# EAGLE schematic OpIoT_jetson_v_1_5 (EAGLE 9.6.2)
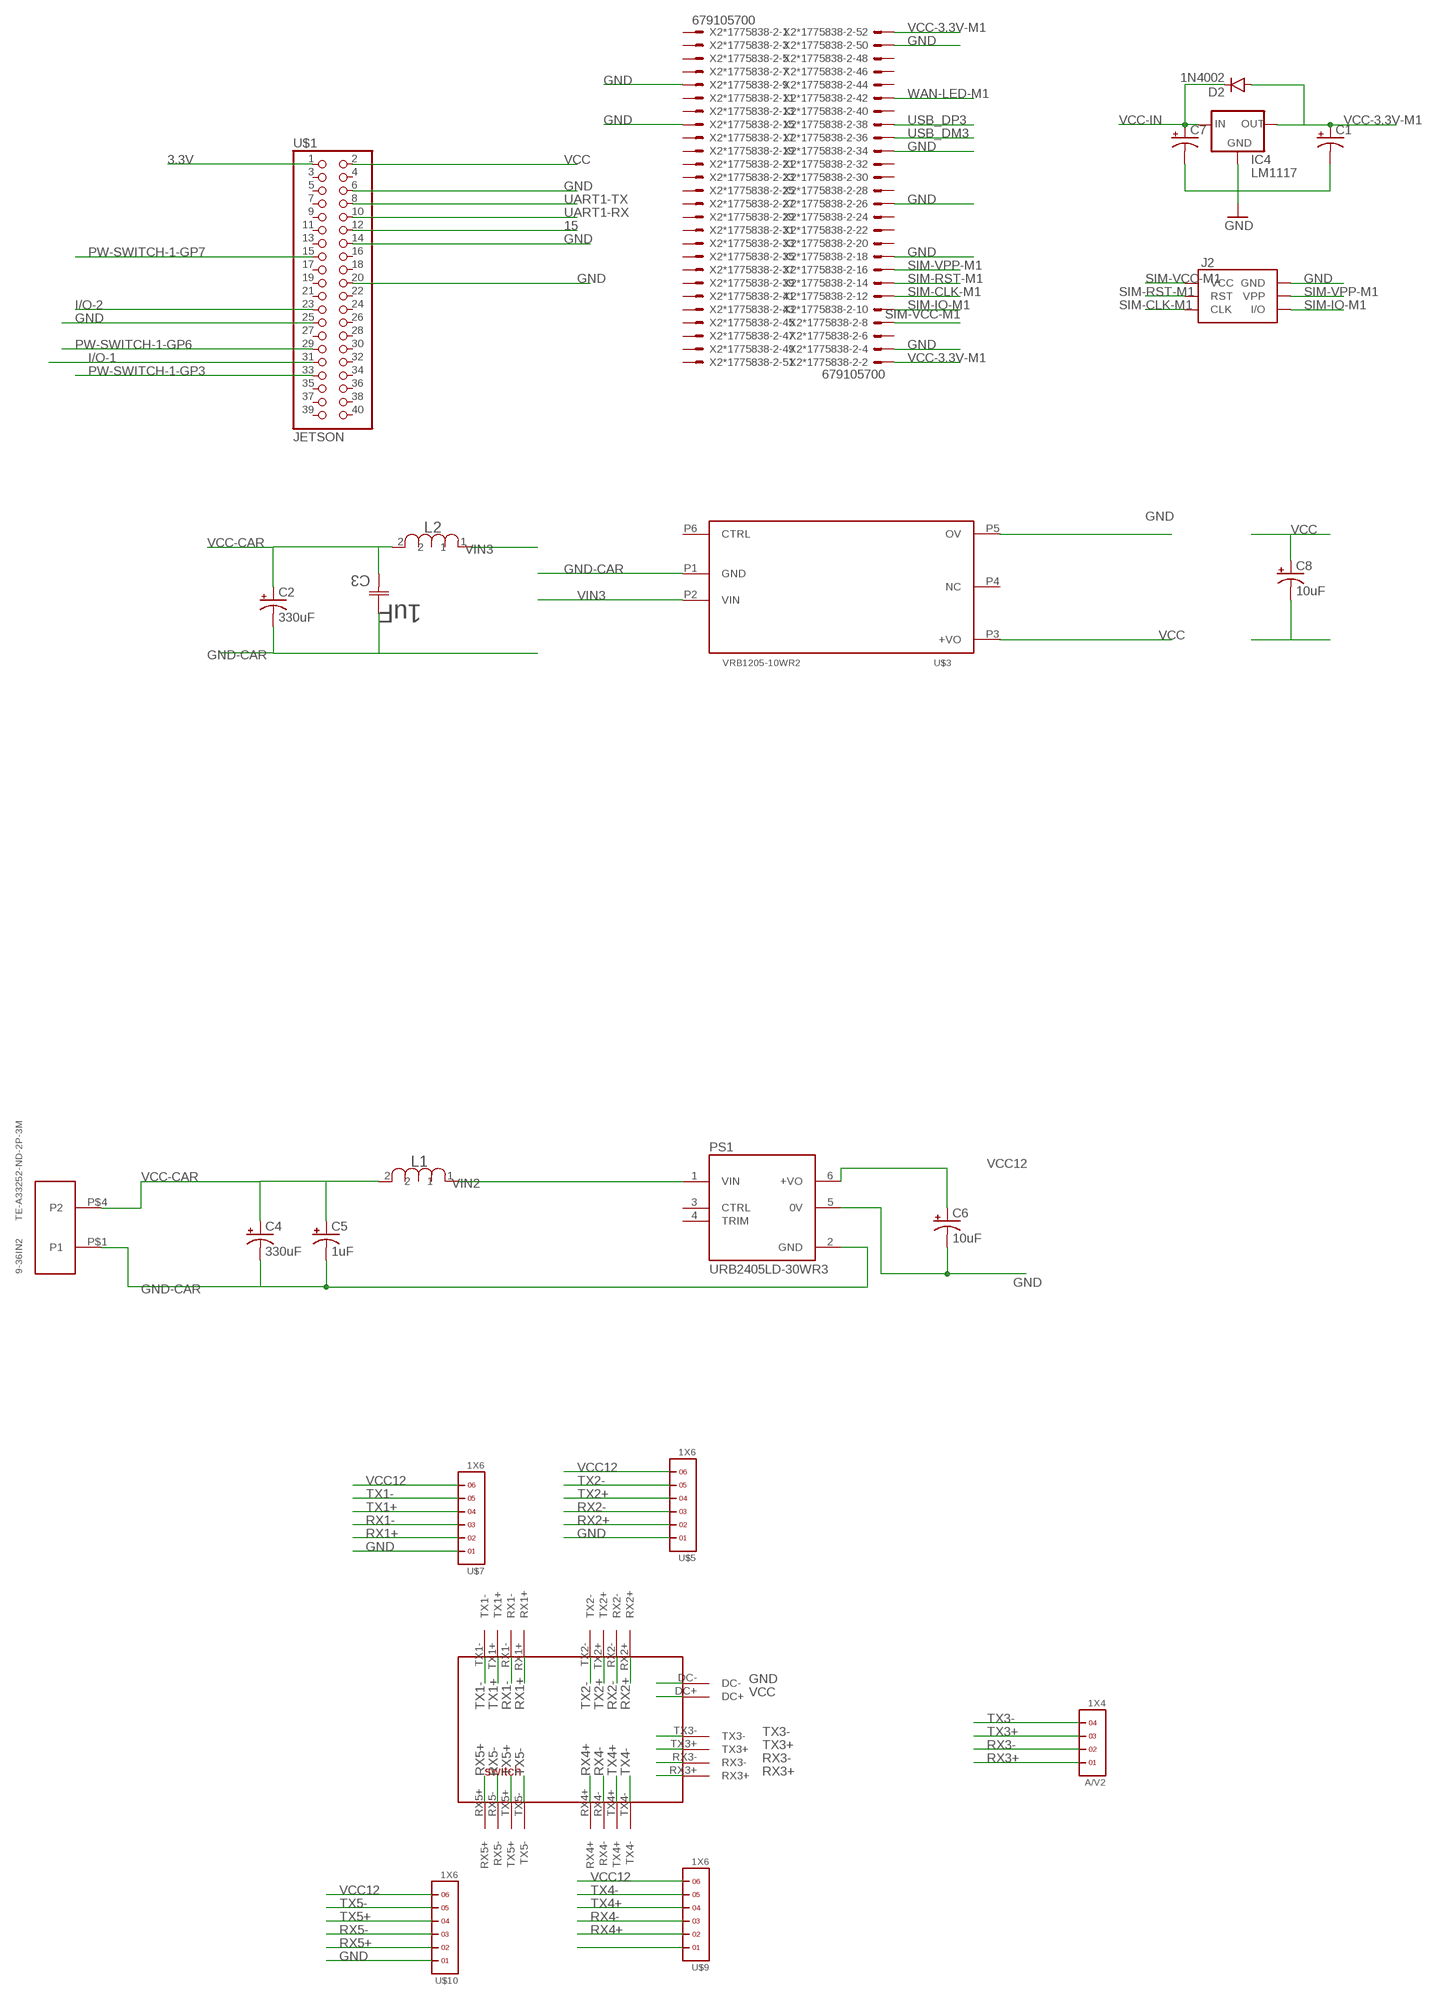
[diagram p0: schematic, sheet 1, part 1 of 3]
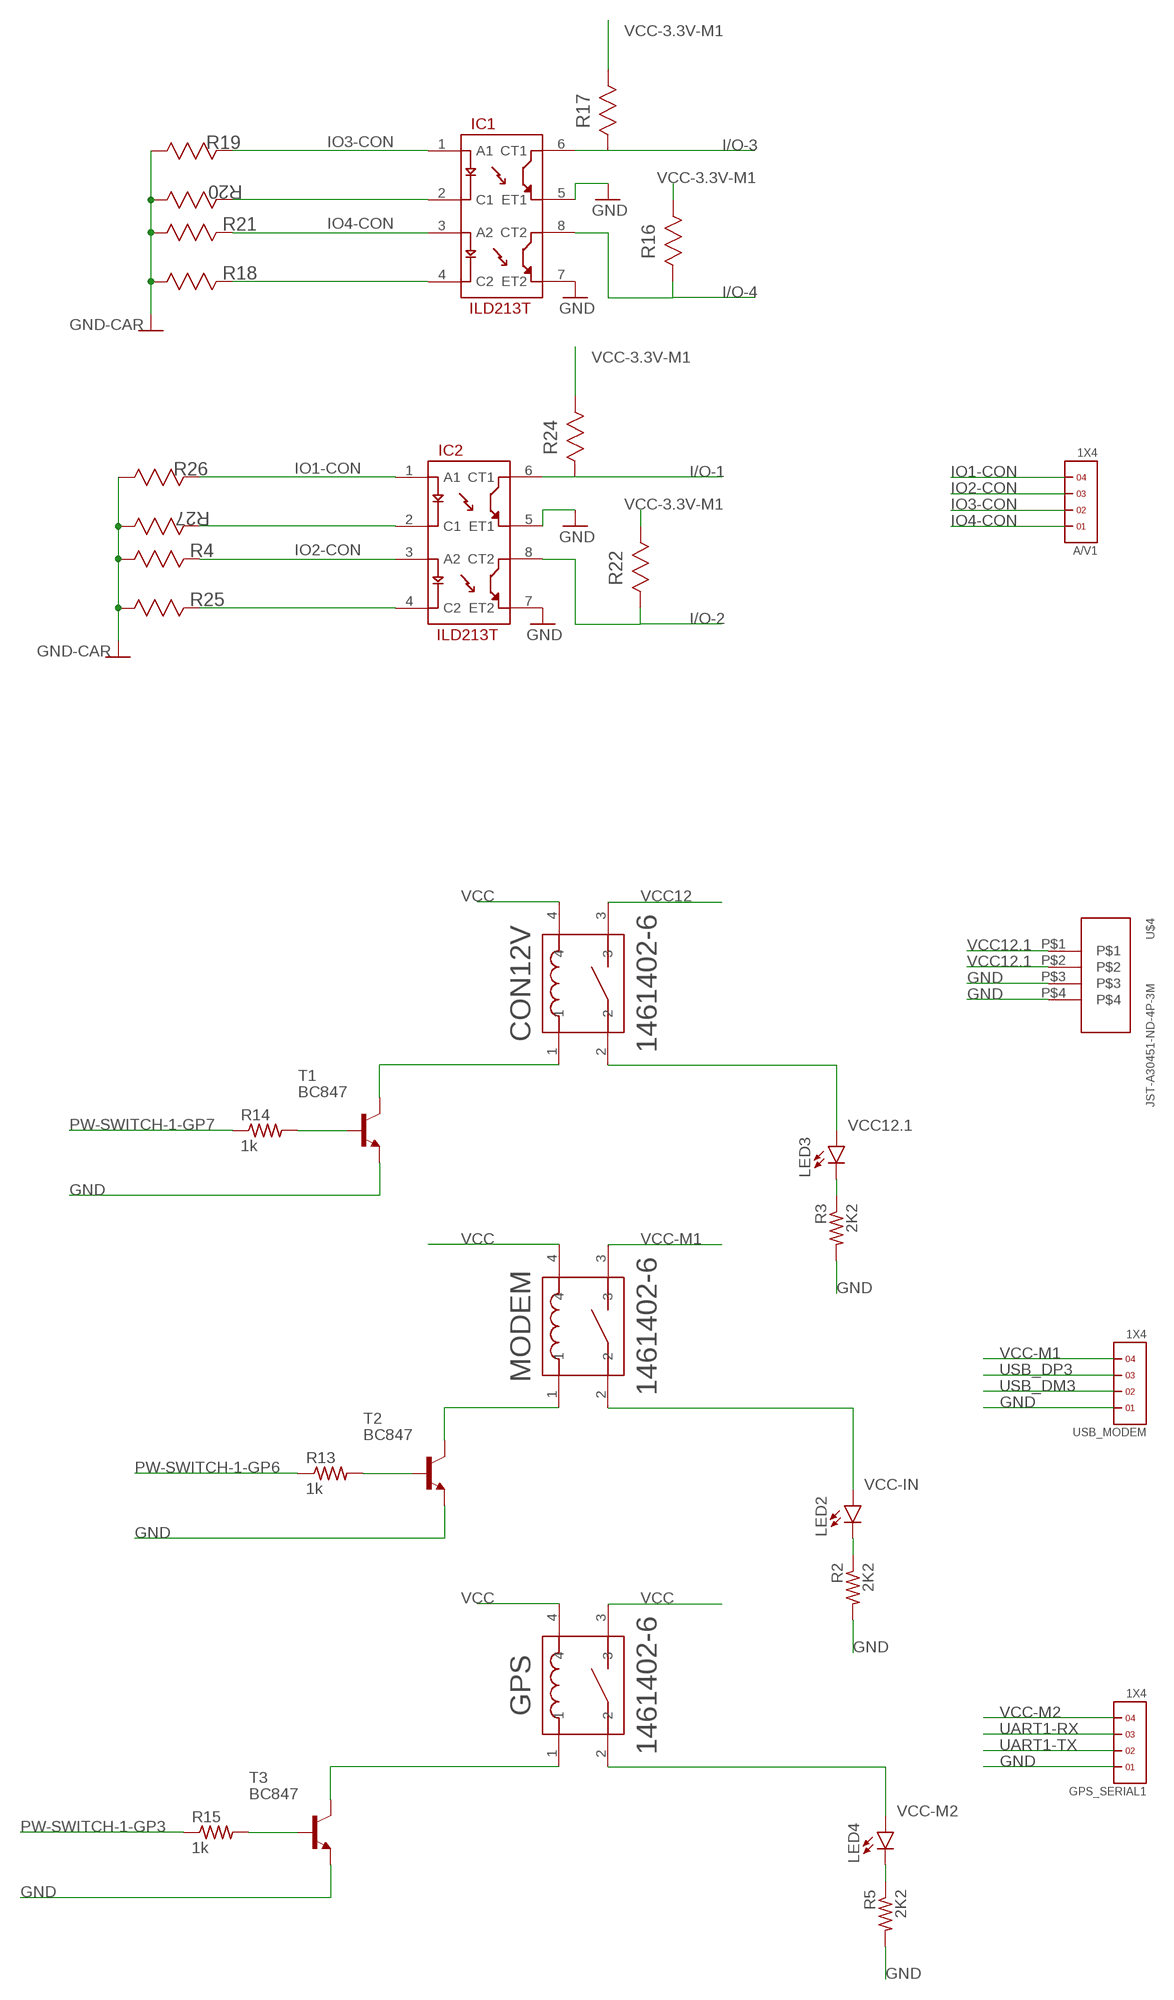
[diagram p1: schematic, sheet 1, part 2 of 3]
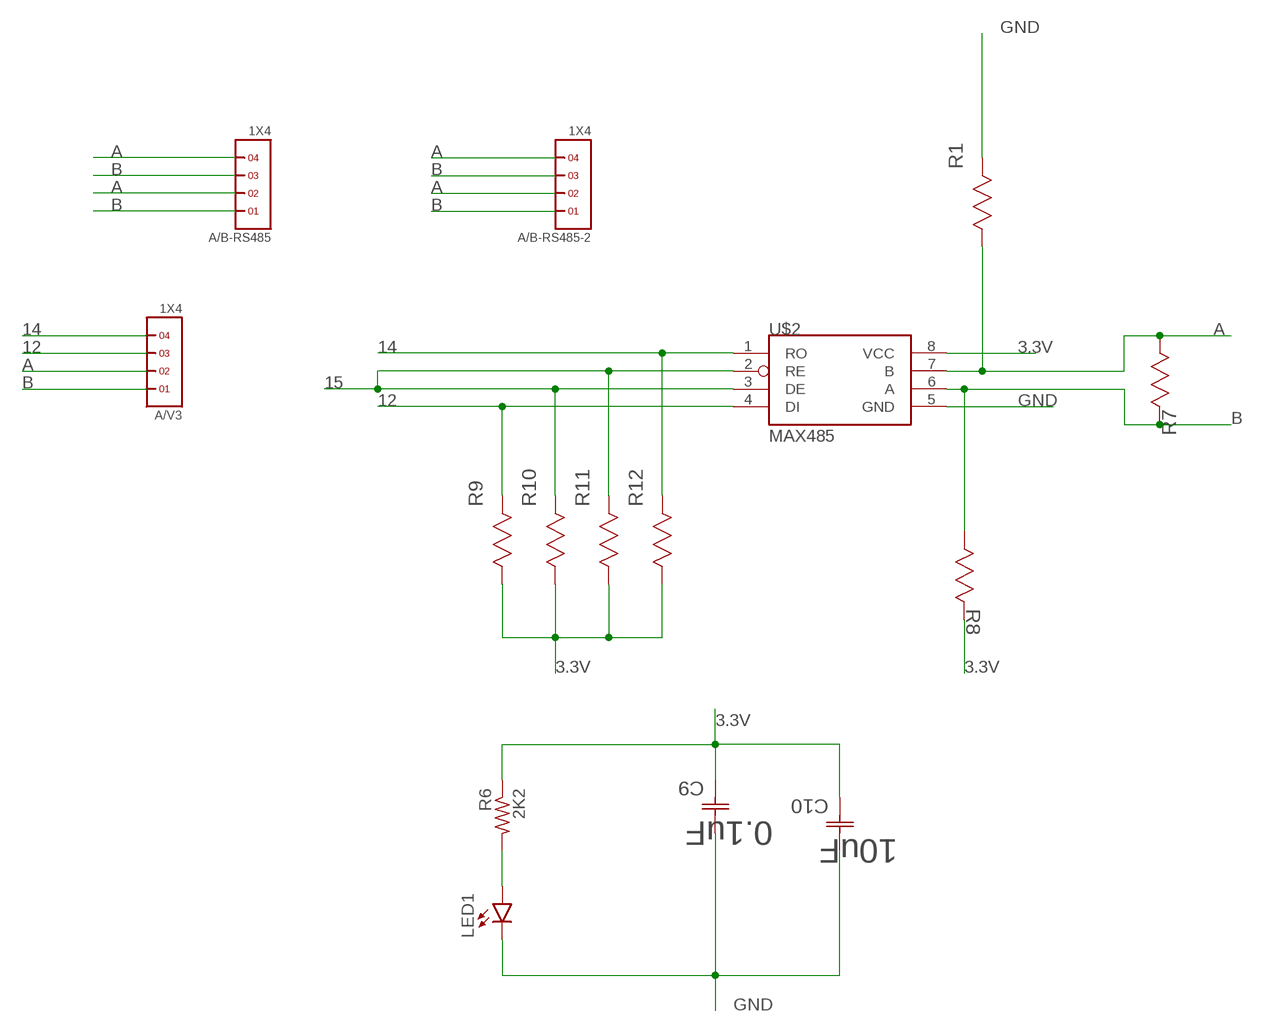
[diagram p2: schematic, sheet 1, part 3 of 3]

## Parts
9-36IN2  TE-A33252-ND-2P-3M  [TE-A33252-ND-2P-3M]
A/B-RS485  1X4  [1X4]
A/B-RS485-2  1X4  [1X4]
A/V1  1X4  [1X4]
A/V2  1X4  [1X4]
A/V3  1X4  [1X4]
C1  CAP_POL1206-KIT  [EIA3216-KIT]
C2  330uF  CPOL-USUD-10X10  [UD-10X10_NICHICON]
C3  1uF  C1206C105K5RACTU  [CAPC3216X110N]
C4  330uF  CPOL-USUD-10X10  [UD-10X10_NICHICON]
C5  1uF  CAP_POL1206-KIT  [EIA3216-KIT]
C6  10uF  CAP_POL1206-KIT  [EIA3216-KIT]
C7  CAP_POL1206-KIT  [EIA3216-KIT]
C8  10uF  CAP_POL1206-KIT  [EIA3216-KIT]
C9  0.1uF  C1206C105K5RACTU  [CAPC3216X110N]
C10  10uF  C1206C105K5RACTU  [CAPC3216X110N]
CON12V  1461402-6  [RELAY_1461402-6]
D2  1N4002  DIODESMA-KIT  [SMA-DIODE-KIT]
GPS  1461402-6  [RELAY_1461402-6]
GPS_SERIAL1  1X4  [1X4]
IC1  ILD213T  [SO08]
IC2  ILD213T  [SO08]
IC4  LM1117  [SOT223]
J2  SIMHOLDERSIM  [SIMHOLDER]
L1  4.7uH  PM1210-1R0J-RC  [INDC3225X22N]
L2  4.7uH  PM1210-1R0J-RC  [INDC3225X22N]
LED1  LEDCHIPLED_1206  [CHIPLED_1206]
LED2  LEDCHIPLED_1206  [CHIPLED_1206]
LED3  LEDCHIPLED_1206  [CHIPLED_1206]
LED4  LEDCHIPLED_1206  [CHIPLED_1206]
MODEM  1461402-6  [RELAY_1461402-6]
PS1  URB2405LD-30WR3  [CONV_URB2405LD-30WR3]
R1  20K  ERJ-8ENF1501V  [RESC3216X71N]
R2  2K2  R-US_M1206  [M1206]
R3  2K2  R-US_M1206  [M1206]
R4  4K7  ERJ-8ENF1501V  [RESC3216X71N]
R5  2K2  R-US_M1206  [M1206]
R6  2K2  R-US_M1206  [M1206]
R7  120  ERJ-8ENF1501V  [RESC3216X71N]
R8  20k  ERJ-8ENF1501V  [RESC3216X71N]
R9  10k  ERJ-8ENF1501V  [RESC3216X71N]
R10  10k  ERJ-8ENF1501V  [RESC3216X71N]
R11  10k  ERJ-8ENF1501V  [RESC3216X71N]
R12  10k  ERJ-8ENF1501V  [RESC3216X71N]
R13  1k  R-US_M1406  [M1406]
R14  1k  R-US_M1406  [M1406]
R15  1k  R-US_M1406  [M1406]
R16  300K  ERJ-8ENF1501V  [RESC3216X71N]
R17  300K  ERJ-8ENF1501V  [RESC3216X71N]
R18  2.2K  ERJ-8ENF1501V  [RESC3216X71N]
R19  4K7  ERJ-8ENF1501V  [RESC3216X71N]
R20  2.2K  ERJ-8ENF1501V  [RESC3216X71N]
R21  4K7  ERJ-8ENF1501V  [RESC3216X71N]
R22  300K  ERJ-8ENF1501V  [RESC3216X71N]
R24  300K  ERJ-8ENF1501V  [RESC3216X71N]
R25  2.2K  ERJ-8ENF1501V  [RESC3216X71N]
R26  ERJ-8ENF1501V  [RESC3216X71N]
R27  2.2K  ERJ-8ENF1501V  [RESC3216X71N]
T1  BC847  [SOT23]
T2  BC847  [SOT23]
T3  BC847  [SOT23]
U$1  JETSON  [2X20]
U$2  MAX485  [SO08]
U$3  VRB1205-10WR2  [MORNSUN-5V]
U$4  JST-A30451-ND-4P-3M  [TE-A30451-4P-TH-3M]
U$5  1X6  [1X6]
U$6  SWITCH  [JP4]
U$7  1X6  [1X6]
U$9  1X6  [1X6]
U$10  1X6  [1X6]
USB_MODEM  1X4  [1X4]
X2*1775838-2  679105700  [679105700]

## Nets
3.3V: C9.2(C2) C10.2(C2) R6.1 R8.1(R1) R9.2(R2) R10.2(R2) R11.2(R2) R12.2(R2) U$1.1 U$2.8(VCC)
12: A/V3.3 R9.1(R1) U$2.4(DI)
14: A/V3.4 R12.1(R1) U$2.1(RO)
15: R10.1(R1) R11.1(R1) U$1.12 U$2.2(RE) U$2.3(DE)
A: A/B-RS485-2.2 A/B-RS485-2.4 A/B-RS485.2 A/B-RS485.4 A/V3.2 R1.2(R2) R7.1(R1) U$2.7(B)
B: A/B-RS485-2.1 A/B-RS485-2.3 A/B-RS485.1 A/B-RS485.3 A/V3.1 R7.2(R2) R8.2(R2) U$2.6(A)
GND: C1.C(-) C6.C(-) C7.C(-) C8.C(-) C9.1(C1) C10.1(C1) GPS_SERIAL1.1 IC1.5(ET1) IC1.7(ET2) IC2.5(ET1) IC2.7(ET2) IC4.1(GND) J2.C5(GND) LED1.C PS1.5(0V) R1.1(R1) R2.2 R3.2 R5.2 T1.2(E) T2.2(E) T3.2(E) U$1.6 U$1.14 U$1.20 U$1.25 U$2.5(GND) U$3.P5(OV) U$4.P$3 U$4.P$4 U$5.1 U$6.DC- U$7.1 U$9.1 U$10.1 USB_MODEM.1 X2*1775838-2.4 X2*1775838-2.9 X2*1775838-2.15 X2*1775838-2.18 X2*1775838-2.26 X2*1775838-2.34 X2*1775838-2.50
GND-CAR: 9-36IN2.P$1(P1) C2.- C3.1(C1) C4.- C5.C(-) PS1.2(GND) R4.2(R2) R18.1(R1) R19.2(R2) R20.1(R1) R21.2(R2) R25.1(R1) R26.2(R2) R27.1(R1) U$3.P1(GND)
GPIO1: CON12V.1 T1.3(C)
GPIO2: GPS.1 T3.3(C)
GPIO16: MODEM.1 T2.3(C)
I/O-1: IC2.6(CT1) R24.2(R2) U$1.31
I/O-2: IC2.8(CT2) R22.2(R2) U$1.23
I/O-3: IC1.6(CT1) R17.2(R2)
I/O-4: IC1.8(CT2) R16.2(R2)
IO1-CON: A/V1.4 IC2.1(A1) R26.1(R1)
IO2-CON: A/V1.3 IC2.3(A2) R4.1(R1)
IO3-CON: A/V1.2 IC1.1(A1) R19.1(R1)
IO4-CON: A/V1.1 IC1.3(A2) R21.1(R1)
N$2: LED1.A R6.2
N$3: LED2.C R2.1
N$4: LED3.C R3.1
N$5: LED4.C R5.1
N$6: R13.2 T2.1(B)
N$7: IC2.2(C1) R27.2(R2)
N$8: R14.2 T1.1(B)
N$9: IC2.4(C2) R25.2(R2)
N$10: R15.2 T3.1(B)
N$11: IC1.2(C1) R20.2(R2)
N$15: IC1.4(C2) R18.2(R2)
PW-SWITCH-1-GP3: R15.1 U$1.33
PW-SWITCH-1-GP6: R13.1 U$1.29
PW-SWITCH-1-GP7: R14.1 U$1.15
RX1+: U$6.RX1+ U$7.2
RX1-: U$6.RX1- U$7.3
RX2+: U$5.2 U$6.RX2+
RX2-: U$5.3 U$6.RX2-
RX3+: A/V2.1 U$6.RX3+
RX3-: A/V2.2 U$6.RX3-
RX4+: U$6.RX4+ U$9.2
RX4-: U$6.RX4- U$9.3
RX5+: U$6.RX5+ U$10.2
RX5-: U$6.RX5- U$10.3
SIM-CLK-M1: J2.C3(CLK) X2*1775838-2.12
SIM-IO-M1: J2.C7(I/O) X2*1775838-2.10
SIM-RST-M1: J2.C2(RST) X2*1775838-2.14
SIM-VCC-M1: J2.C1(VCC) X2*1775838-2.8
SIM-VPP-M1: J2.C6(VPP) X2*1775838-2.16
TX1+: U$6.TX1+ U$7.4
TX1-: U$6.TX1- U$7.5
TX2+: U$5.4 U$6.TX2+
TX2-: U$5.5 U$6.TX2-
TX3+: A/V2.3 U$6.TX3+
TX3-: A/V2.4 U$6.TX3-
TX4+: U$6.TX4+ U$9.4
TX4-: U$6.TX4- U$9.5
TX5+: U$6.TX5+ U$10.4
TX5-: U$6.TX5- U$10.5
UART1-RX: GPS_SERIAL1.3 U$1.10
UART1-TX: GPS_SERIAL1.2 U$1.8
USB_DM3: USB_MODEM.2 X2*1775838-2.36
USB_DP3: USB_MODEM.3 X2*1775838-2.38
VCC: C8.A(+) CON12V.4 GPS.3 GPS.4 MODEM.4 U$1.2 U$3.P3(+VO) U$6.DC+
VCC12: C6.A(+) CON12V.3 PS1.6(+VO) U$5.6 U$7.6 U$9.6 U$10.6
VCC12.1: CON12V.2 LED3.A U$4.P$1 U$4.P$2
VCC-3.3V-M1: C1.A(+) D2.A IC4.2(OUT) R16.1(R1) R17.1(R1) R22.1(R1) R24.1(R1) X2*1775838-2.2 X2*1775838-2.52
VCC-CAR: 9-36IN2.P$4(P2) C2.+ C3.2(C2) C4.+ C5.A(+) L1.2 L2.2
VCC-IN: C7.A(+) D2.C IC4.3(IN) LED2.A MODEM.2
VCC-M1: MODEM.3 USB_MODEM.4
VCC-M2: GPS.2 GPS_SERIAL1.4 LED4.A
VIN2: L1.1 PS1.1(VIN)
VIN3: L2.1 U$3.P2(VIN)
WAN-LED-M1: X2*1775838-2.42
Unconnected: PS1.3(CTRL) PS1.4(TRIM) U$1.3 U$1.4 U$1.5 U$1.7 U$1.9 U$1.11 U$1.13 U$1.16 U$1.17 U$1.18 U$1.19 U$1.21 U$1.22 U$1.24 U$1.26 U$1.27 U$1.28 U$1.30 U$1.32 U$1.34 U$1.35 U$1.36 U$1.37 U$1.38 U$1.39 U$1.40 U$3.P4(NC) U$3.P6(CTRL) X2*1775838-2.1 X2*1775838-2.3 X2*1775838-2.5 X2*1775838-2.6 X2*1775838-2.7 X2*1775838-2.11 X2*1775838-2.13 X2*1775838-2.17 X2*1775838-2.19 X2*1775838-2.20 X2*1775838-2.21 X2*1775838-2.22 X2*1775838-2.23 X2*1775838-2.24 X2*1775838-2.25 X2*1775838-2.27 X2*1775838-2.28 X2*1775838-2.29 X2*1775838-2.30 X2*1775838-2.31 X2*1775838-2.32 X2*1775838-2.33 X2*1775838-2.35 X2*1775838-2.37 X2*1775838-2.39 X2*1775838-2.40 X2*1775838-2.41 X2*1775838-2.43 X2*1775838-2.44 X2*1775838-2.45 X2*1775838-2.46 X2*1775838-2.47 X2*1775838-2.48 X2*1775838-2.49 X2*1775838-2.51

## Library data of the parts
9-36IN2 = MonkeyTech:TE-A33252-ND-2P-3M
A/B-RS485 A/B-RS485-2 A/V1-A/V3 GPS_SERIAL1 USB_MODEM = headers(2mm):1X4
C1 C5-C8 = SparkFun-Passives:CAP_POL: Capacitor Polarized These are standard SMD and PTH capacitors. Normally 10uF, 47uF, and 100uF in electrolytic and tantalum varieties. Always verify the external diameter of the through hole cap, it varies with capacity, voltage, and manufacturer. The EIA devices should be standard.
C2 C4 = rcl:CPOL-US: POLARIZED CAPACITOR, American symbol; SPICEPREFIX: C
C3 = Kemet_By_element14_Batch_1:C1206C105K5RACTU: CAPACITOR, 1206; MPN: C1206C105K5RACTU; OC_FARNELL: 1288207; OC_NEWARK: 93K6006; SUPPLIER: Kemet; TOLERANCE: ±10%; VOLTAGERATING: 50V
C9 C10 = Kemet_By_element14_Batch_1:C1206C105K5RACTU: CAPACITOR, 1206; MPN: C1206C105K5RACTU; OC_FARNELL: 1288207; OC_NEWARK: 93K6006; SUPPLIER: Kemet; TOLERANCE: ±10%; VALUE: 1uF; VOLTAGERATING: 50V
CON12V GPS MODEM = 1461402-6:1461402-6: Electromechanical Relay 12VDC 320Ohm 10A SPST-NO (( 18.2mm 10.2mm 14.7mm)) THT Industrial Relay Check prices <https://pricing.snapeda.com/search/part/OJE-SH-112HM%2C000/?ref=eda>; AVAILABILITY: Warning; COMMENT: 1461402-6; DESCRIPTION: Electromechanical Relay 12VDC 320Ohm 10A SPST-NO (( 18.2mm 10.2mm 14.7mm)) THT Industrial Relay; MF: TE Connectivity; MP: OJE-SH-112HM,000; PACKAGE: None; PRICE: None; PURCHASE-URL: https://pricing.snapeda.com/search/part/OJE-SH-112HM,000/?ref=eda
D2 = SparkFun-DiscreteSemi:DIODE: Diode These are standard reverse protection diodes and small signal diodes. SMA package can handle up to about 1A. SOD-323 can handle about 200mA. What the SOD-323 package when ordering, there are some mfgs out there that are 5-pin packages.
IC1 IC2 = SparkFun-DiscreteSemi:ILD213T: Dual optoisolator.
IC4 = LM1117:LM1117; AVAILABILITY: Good; DESCRIPTION: Voltage stabiliser; LDO, fixed; 3.3V; 0.8A; SOT223; SMD; MF: Texas Instruments; MP: LM1117MP-3.3/NOPB; PACKAGE: SOT-223 Texas Instruments; PRICE: 0.61 USD
J2 = SparkFun-Connectors:SIMHOLDER: SIM Socket Socket for SIM cellular cards. Schematic element and footprint production proven. Spark Fun Electronics SKU : PRT-00548; PROD_ID: CONN-08536
L1 L2 = Bourns_By_element14_Batch_1:PM1210-1R0J-RC: CHIP INDUCTOR, 1UH, 400MA 5% 120MHZ; MPN: PM1210-1R0J-RC; OC_FARNELL: 1180462; OC_NEWARK: 63K3090; SUPPLIER: BOURNS; TOLERANCE: ±5 %; VALUE: 1.0 uH
LED1-LED4 = led:LED: LED OSRAM: - CHIPLED LG R971, LG N971, LY N971, LG Q971, LY Q971, LO R971, LY R971 LH N974, LH R974 LS Q976, LO Q976, LY Q976 LO Q996 - Hyper CHIPLED LW Q18S LB Q993, LB Q99A, LB R99A - SideLED LS A670, LO A670, LY A670, LG A670, LP A670 LB A673, LV A673, LT A673, LW A673 LH A674 LY A675 LS A676, LA A676, LO A676, LY A676, LW A676 LS A679, LY A679, LG A679 - Hyper Micro SIDELED® LS Y876, LA Y876, LO Y876, LY Y876 LT Y87S - SmartLED LW L88C, LW L88S LB L89C, LB L89S, LG L890 LS L89K, LO L89K, LY L89K LS L896, LA L896, LO L896, LY L896 - TOPLED LS T670, LO T670, LY T670, LG T670, LP T670 LSG T670, LSP T670, LSY T670, LOP T670, LYG T670 LG T671, LOG T671, LSG T671 LB T673, LV T673, LT T673, LW T673 LH T674 LS T676, LA T676, LO T676, LY T676, LB T676, LH T676, LSB T676, LW T676 LB T67C, LV T67C, LT T67C, LS T67K, LO T67K, LY T67K, LW E67C LS E67B, LA E67B, LO E67B, LY E67B, LB E67C, LV E67C, LT E67C LW T67C LS T679, LY T679, LG T679 LS T770, LO T770, LY T770, LG T770, LP T770 LB T773, LV T773, LT T773, LW T773 LH T774 LS E675, LA E675, LY E675, LS T675 LS T776, LA T776, LO T776, LY T776, LB T776 LHGB T686 LT T68C, LB T68C - Hyper Mini TOPLED® LB M676 - Mini TOPLED Santana® LG M470 LS M47K, LO M47K, LY M47K Source: http://www.osram.convergy.de LUXEON: - LUMILED® LXK2-PW12-R00, LXK2-PW12-S00, LXK2-PW14-U00, LXK2-PW14-V00 LXK2-PM12-R00, LXK2-PM12-S00, LXK2-PM14-U00 LXK2-PE12-Q00, LXK2-PE12-R00, LXK2-PE12-S00, LXK2-PE14-T00, LXK2-PE14-U00 LXK2-PB12-K00, LXK2-PB12-L00, LXK2-PB12-M00, LXK2-PB14-N00, LXK2-PB14-P00, LXK2-PB14-Q00 LXK2-PR12-L00, LXK2-PR12-M00, LXK2-PR14-Q00, LXK2-PR14-R00 LXK2-PD12-Q00, LXK2-PD12-R00, LXK2-PD12-S00 LXK2-PH12-R00, LXK2-PH12-S00 LXK2-PL12-P00, LXK2-PL12-Q00, LXK2-PL12-R00 Source: www.luxeon.com KINGBRIGHT: KA-3528ASYC Source: www.kingbright.com
PS1 = URB2405LD-30WR3:URB2405LD-30WR3: URB_LD-30WR3 series are isolated 30W DC-DC products with 4:1 input voltage; AVAILABILITY: Unavailable; DESCRIPTION: URB_LD-30WR3 series are isolated 30W DC-DC products with 4:1 input voltage; MF: MORNSUN; MP: URB2405LD-30WR3; PACKAGE: Package; PRICE: None
R1 R4 R7-R12 R16-R22 R24-R27 = Panasonic_By_element14_Batch_1:ERJ-8ENF1501V: RESISTOR, 1206; MPN: ERJ-8ENF1501V; OC_FARNELL: 1748434; OC_NEWARK: 64R5441; SUPPLIER: Panasonic; TOLERANCE: ±1 %; VALUE: 1.5 KOhm; WATTAGE: 0.25 W
R2 R3 R5 R6 R13-R15 = rcl:R-US_: RESISTOR, American symbol; SPICEPREFIX: R
T1-T3 = transistor:BC847: NPN TRANSISTOR
U$1 = Jetson:JETSON
U$2 = MAX485:MAX485; AVAILABILITY: Unavailable; DESCRIPTION: 1/1 Transceiver Half RS422, RS485 8-uMAX; MF: Maxim Integrated; MP: MAX485; PACKAGE: SOIC-8 Maxim Integrated; PRICE: None
U$3 = MonkeyTech:VRB1205-10WR2
U$4 = MonkeyTech:JST-A30451-ND-4P-3M
U$5 U$7 U$9 U$10 = headers(2mm):1X6
U$6 = switch2:SWITCH
X2*1775838-2 = con-molex:679105700: MINI PCI EXPRESS CONNECTOR 0.8MM PITCH, 52 CIRCUIT Source: http://www.molex.com/pdm_docs/sd/679105700_sd.pdf; MF: MOLEX; MPN: 67910-5700; OC_FARNELL: unknown; OC_NEWARK: 93M2128

## Net classes
1 power: width 0.305 mm